# EAGLE design msgeq7-simple (EAGLE 6.5.0)
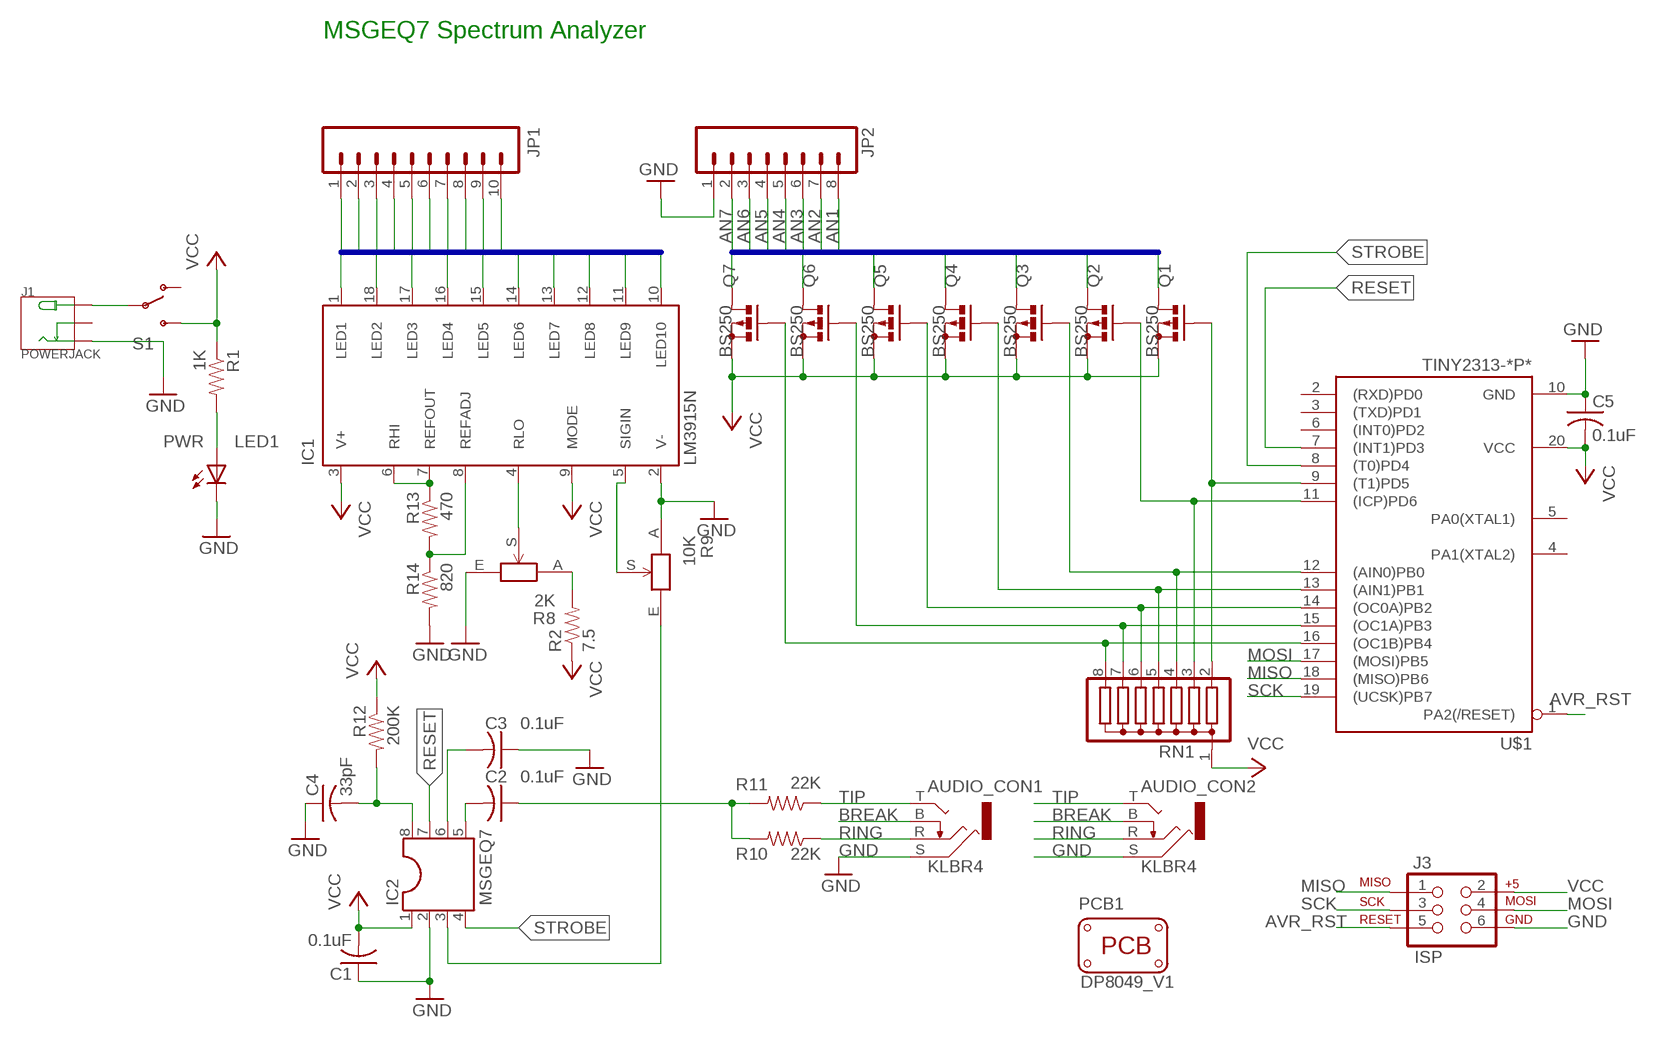
[diagram p0: schematic, sheet 1]

## Parts
AUDIO_CON1  KLBR4  [KLBR4]
AUDIO_CON2  KLBR4  [KLBR4]
C1  0.1uF  C-US025-025X050  [C025-025X050]
C2  0.1uF  C-US025-025X050  [C025-025X050]
C3  0.1uF  C-US025-025X050  [C025-025X050]
C4  33pF  C-US025-025X050  [C025-025X050]
C5  0.1uF  C-US025-025X050  [C025-025X050]
IC1  LM3915N  [DIL18]
IC2  MSGEQ7  DIL8  [DIL08]
J1  POWERJACK  JACK-DC-3P-3410020P1  [PW-3P-2.1]
J3  ISP  AVR_SPI_PRG_6PTH  [2X3]
JP1  M10"  [1X10]
JP2  M081X08  [1X08]
LED1  PWR  LED3MM  [LED3MM]
PCB1  PCB_DP_RECTANGLE-80X49  [DP8049_V1]
Q1  BS250  BS250TO92-E  [TO92-E-LINE]
Q2  BS250  BS250TO92-E  [TO92-E-LINE]
Q3  BS250  BS250TO92-E  [TO92-E-LINE]
Q4  BS250  BS250TO92-E  [TO92-E-LINE]
Q5  BS250  BS250TO92-E  [TO92-E-LINE]
Q6  BS250  BS250TO92-E  [TO92-E-LINE]
Q7  BS250  BS250TO92-E  [TO92-E-LINE]
R1  1K  RESISTORPTH-1/4W  [AXIAL-0.4]
R2  7.5  RESISTORPTH-1/4W  [AXIAL-0.4]
R8  2K  TPOT3352  [3352T]
R9  10K  TPOT3352  [3352T]
R10  22K  RESISTORPTH-1/4W  [AXIAL-0.4]
R11  22K  RESISTORPTH-1/4W  [AXIAL-0.4]
R12  200K  RESISTORPTH-1/4W  [AXIAL-0.4]
R13  470  RESISTORPTH-1/4W  [AXIAL-0.4]
R14  820  RESISTORPTH-1/4W  [AXIAL-0.4]
RN1  G07R  [SIL8]
S1  SWITCH-SPDTPTH  [SWITCH-SPDT]
U$1  TINY2313-*P*  [DIL20]

## Nets
AN1: JP2.8 Q1.D
AN2: JP2.7 Q2.D
AN3: JP2.6 Q3.D
AN4: JP2.5 Q4.D
AN5: JP2.4 Q5.D
AN6: JP2.3 Q6.D
AN7: JP2.2 Q7.D
AVR_RST: J3.5 U$1.1(PA2(/RESET))
BREAK: AUDIO_CON1.B AUDIO_CON2.B
CAT1: IC1.1(LED1) JP1.1
CAT2: IC1.18(LED2) JP1.2
CAT3: IC1.17(LED3) JP1.3
CAT4: IC1.16(LED4) JP1.4
CAT5: IC1.15(LED5) JP1.5
CAT6: IC1.14(LED6) JP1.6
CAT7: IC1.13(LED7) JP1.7
CAT8: IC1.12(LED8) JP1.8
CAT9: IC1.11(LED9) JP1.9
CAT10: IC1.10(LED10) JP1.10
GND: AUDIO_CON1.S AUDIO_CON2.S C1.1 C3.1 C4.1 C5.1 IC1.2(V-) IC2.2 J1.-1(-) J3.6 JP2.1 LED1.K(C) R8.E R9.A R14.P$2 U$1.10(GND)
MISO: J3.1 U$1.18((MISO)PB6)
MOSI: J3.4 U$1.17((MOSI)PB5)
N$1: Q7.G RN1.8 U$1.16((OC1B)PB4)
N$2: Q6.G RN1.7 U$1.15((OC1A)PB3)
N$3: Q5.G RN1.6 U$1.14((OC0A)PB2)
N$4: Q4.G RN1.5 U$1.13((AIN1)PB1)
N$5: Q3.G RN1.4 U$1.12((AIN0)PB0)
N$6: Q2.G RN1.3 U$1.11((ICP)PD6)
N$7: Q1.G RN1.2 U$1.9((T1)PD5)
N$8: IC1.4(RLO) R8.S
N$9: IC1.5(SIGIN) R9.S
N$10: C2.2 IC2.5
N$11: IC2.3 R9.E
N$12: J1.+ S1.2(P)
N$13: C2.1 R10.P$2 R11.P$2
N$14: C3.2 IC2.6
N$15: C4.2 IC2.8 R12.P$2
N$16: IC1.6(RHI) IC1.7(REFOUT) R13.P$1
N$17: IC1.8(REFADJ) R13.P$2 R14.P$1
N$18: LED1.A R1.P$2
N$19: R2.P$2 R8.A
RESET: IC2.7 U$1.7((INT1)PD3)
RING: AUDIO_CON1.R AUDIO_CON2.R R10.P$1
SCK: J3.3 U$1.19((UCSK)PB7)
STROBE: IC2.4 U$1.8((T0)PD4)
TIP: AUDIO_CON1.T AUDIO_CON2.T R11.P$1
VCC: C1.2 C5.2 IC1.3(V+) IC1.9(MODE) IC2.1 J3.2 Q1.S Q2.S Q3.S Q4.S Q5.S Q6.S Q7.S R1.P$1 R2.P$1 R12.P$1 RN1.1 S1.3(S) U$1.20(VCC)
Unconnected: J1.-2(CDN) S1.1(O) U$1.2((RXD)PD0) U$1.3((TXD)PD1) U$1.4(PA1(XTAL2)) U$1.5(PA0(XTAL1)) U$1.6((INT0)PD2)

## Buses
CAT[1..10]
AN[1..7]

## Notes on the sheet
- MSGEQ7 Spectrum Analyzer

## Library data of the parts
AUDIO_CON1 AUDIO_CON2 = ubiyubix:KLBR4
C1-C5 = rcl:C-US: CAPACITOR, American symbol
IC1 = national-semiconductor:LM391: Dot/Bar Display Driver Source: Data sheet LM3915 <http://www.national.com/ds/LM/LM3915.pdf> Data sheet LM3914 <http://www.national.com/ds/LM/LM3914.pdf>
IC2 = ic-package:DIL8: Dual In Line / Socket
J1 = Connector:JACK-DC-3P
J3 = SparkFun-Connectors:AVR_SPI_PRG_6: AVR ISP 6 Pin This is the reduced ISP connector for AVR programming. Common on Arduino. This footprint will take up less PCB space and can be used with a 10-pin to 6-pin adapter such as SKU: BOB-08508
JP1 = SparkFun-Connectors:M10: Header 10 Standard 10-pin 0.1" header. Use with straight break away headers (SKU : PRT-00116), right angle break away headers (PRT-00553), swiss pins (PRT-00743), machine pins (PRT-00117), and female headers (PRT-00115).
JP2 = SparkFun-Connectors:M08: Header 8 Standard 8-pin 0.1" header. Use with straight break away headers (SKU : PRT-00116), right angle break away headers (PRT-00553), swiss pins (PRT-00743), machine pins (PRT-00117), and female headers (PRT-00115).
LED1 = adafruit:LED: LED OSRAM: - CHIPLED LG R971, LG N971, LY N971, LG Q971, LY Q971, LO R971, LY R971 LH N974, LH R974 LS Q976, LO Q976, LY Q976 LO Q996 - Hyper CHIPLED LW Q18S LB Q993, LB Q99A, LB R99A - SideLED LS A670, LO A670, LY A670, LG A670, LP A670 LB A673, LV A673, LT A673, LW A673 LH A674 LY A675 LS A676, LA A676, LO A676, LY A676, LW A676 LS A679, LY A679, LG A679 - Hyper Micro SIDELED® LS Y876, LA Y876, LO Y876, LY Y876 LT Y87S - SmartLED LW L88C, LW L88S LB L89C, LB L89S, LG L890 LS L89K, LO L89K, LY L89K LS L896, LA L896, LO L896, LY L896 - TOPLED LS T670, LO T670, LY T670, LG T670, LP T670 LSG T670, LSP T670, LSY T670, LOP T670, LYG T670 LG T671, LOG T671, LSG T671 LB T673, LV T673, LT T673, LW T673 LH T674 LS T676, LA T676, LO T676, LY T676, LB T676, LH T676, LSB T676, LW T676 LB T67C, LV T67C, LT T67C, LS T67K, LO T67K, LY T67K, LW E67C LS E67B, LA E67B, LO E67B, LY E67B, LB E67C, LV E67C, LT E67C LW T67C LS T679, LY T679, LG T679 LS T770, LO T770, LY T770, LG T770, LP T770 LB T773, LV T773, LT T773, LW T773 LH T774 LS E675, LA E675, LY E675, LS T675 LS T776, LA T776, LO T776, LY T776, LB T776 LHGB T686 LT T68C, LB T68C - Hyper Mini TOPLED® LB M676 - Mini TOPLED Santana® LG M470 LS M47K, LO M47K, LY M47K Source: http://www.osram.convergy.de/
PCB1 = dp_devices:PCB_DP_RECTANGLE: Dangerous Prototypes Standard Rectangular PCB sizes; PCB_SIZE: DP8049_V1
Q1-Q7 = ubiyubix:BS250: P-CHANNEL MOS FET
R1 R2 R10-R14 = SparkFun-Passives:RESISTOR: Resistor Basic schematic elements and footprints for 0603, 1206, and PTH resistors.
R8 R9 = t0mpr1c3:TPOT: Bourns thumbwheel trimmer resistor
RN1 = resistor-sil:G07R: SIL RESISTOR; OC_FARNELL: unknown; OC_NEWARK: unknown
S1 = ubiyubix:SWITCH-SPDT: SPST Switch Simple slide switch. Spark Fun Electronics SKU : COM-00102
U$1 = avr-7:TINY2313*: Atmel Tiny2313 2K Flash, 128 bytes EEPROM, 128 bytes RAM

## Net classes
0 default: width 0.305 mm, clearance 0.305 mm
1 supply: width 0.406 mm

## Board
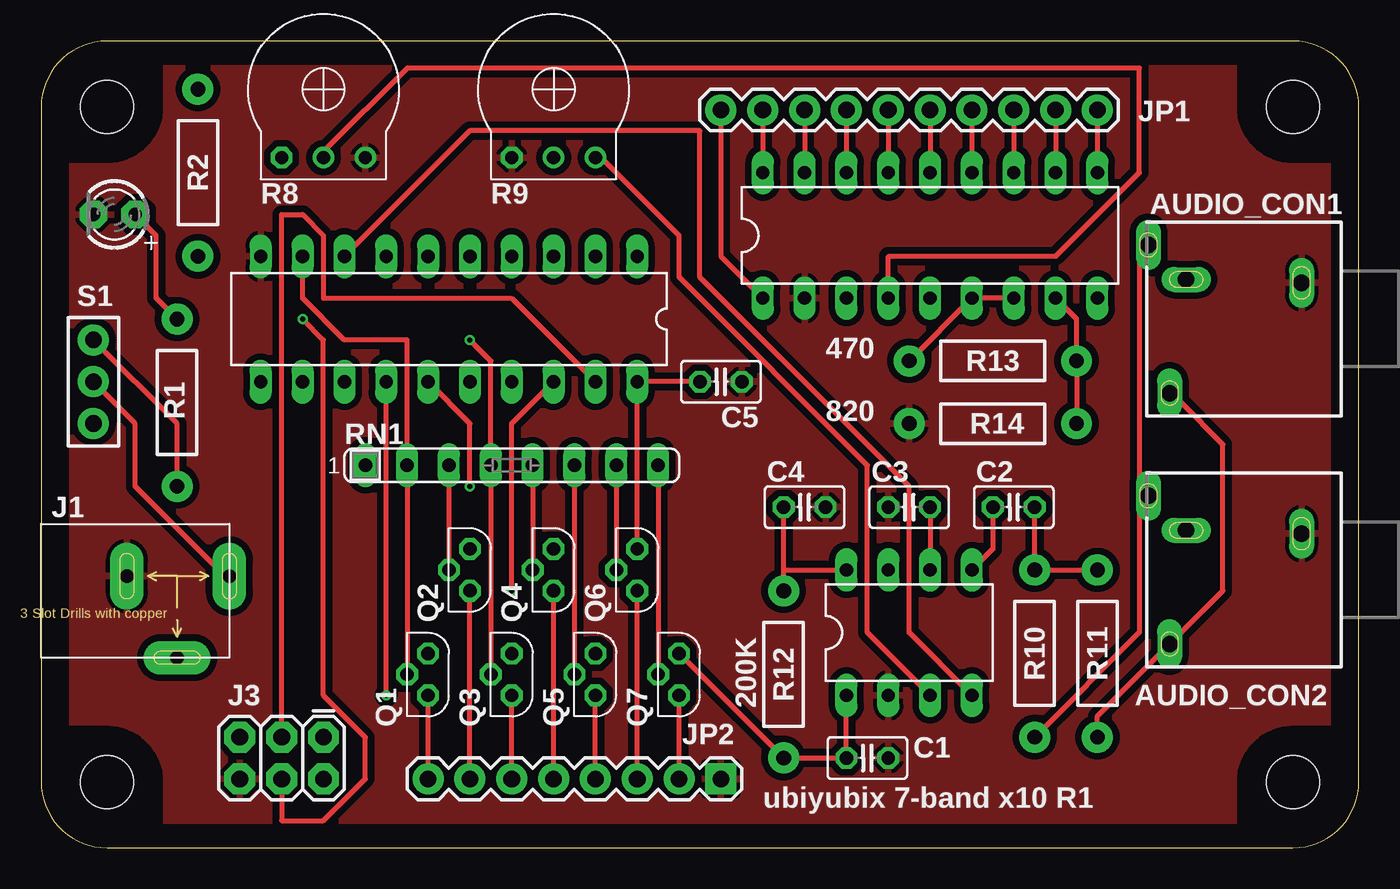
[diagram p1: board, top side]
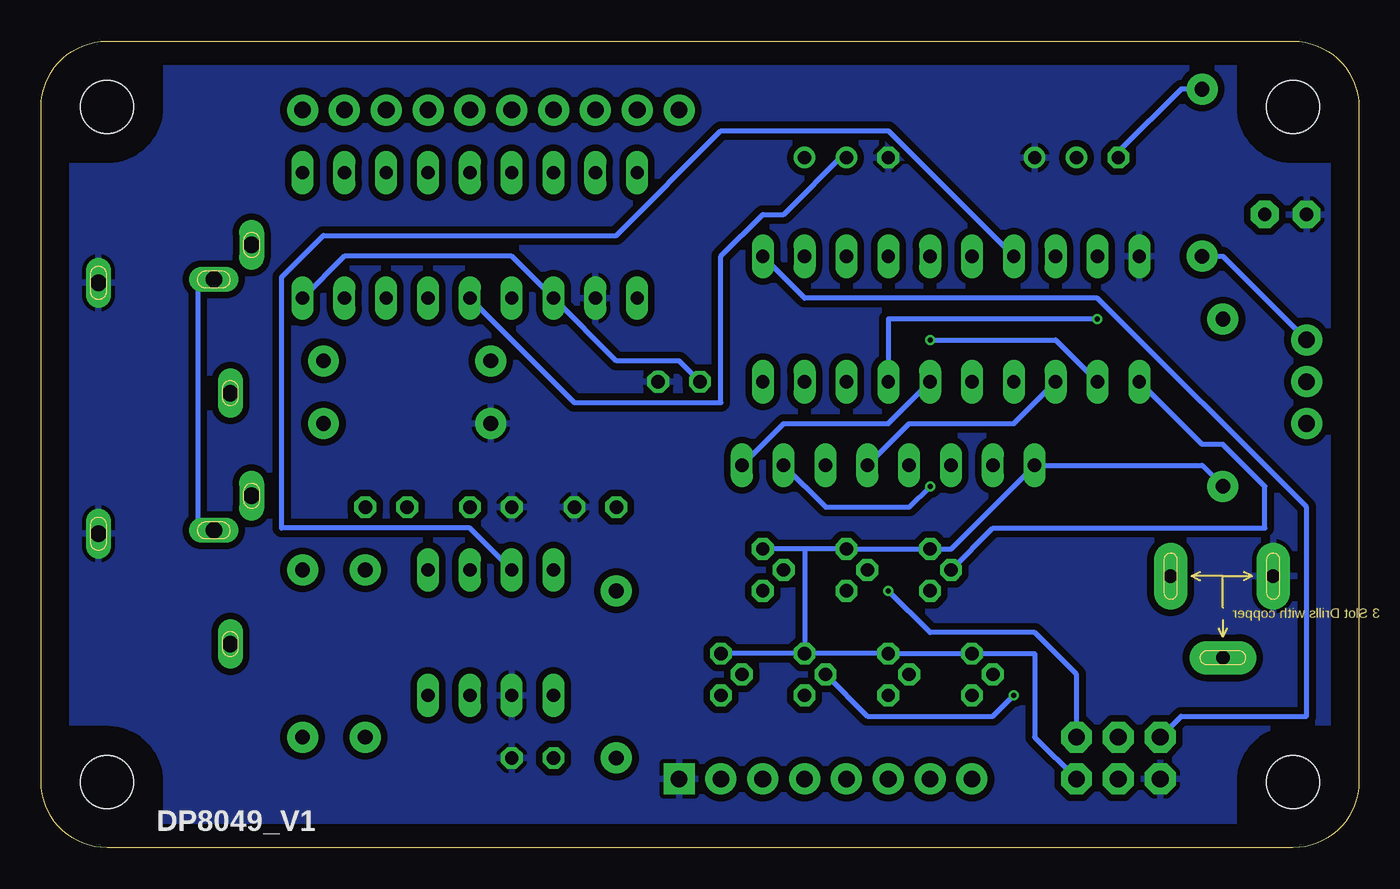
[diagram p2: board, bottom side, seen from below]

Size 80 x 49 mm. Coordinates in mm from the lower left corner, seen from the top.
Copper layers (1*16): Top 0.035mm / dielectric 1.5mm / Bottom 0.035mm
Design rules "SeeedStudio_2layer_DRU_no_angle_20140221": minimum track width 6mil, minimum drill 12mil, track to track 6mil, track to pad 6mil, pad to pad 6mil, via to via 6mil, smd to smd 0mil, copper to edge 10mil, drill to drill 10mil, minimum pad ring 10mil, minimum via ring 6mil, stop-mask expansion 2mil, vias tented up to drill 100mil, thermal gap 10mil

### Footprints (pad centres in the part's own frame; a part is rotated, then mirrored left to right if it is on the bottom)
KLBR4 = drill 1 pad 1.3 long: B -2.4,-3.5; S -2.2,3.5 | drill 1 pad 1.2 long: R -4.5,-5.8; T 4.5,-4.5
C025-025X050 = drill 0.813 octagon: 1 -1.27,0; 2 1.27,0
DIL18 = drill 0.813 long: 1 -10.16,-3.81; 2 -7.62,-3.81; 3 -5.08,-3.81; 4 -2.54,-3.81; 5 0,-3.81; 6 2.54,-3.81; 7 5.08,-3.81; 8 7.62,-3.81; 9 10.16,-3.81; 10 10.16,3.81; 11 7.62,3.81; 12 5.08,3.81; 13 2.54,3.81; 14 0,3.81; 15 -2.54,3.81; 16 -5.08,3.81; 17 -7.62,3.81; 18 -10.16,3.81
DIL08 = drill 0.813 long: 1 -3.81,-3.81; 2 -1.27,-3.81; 3 1.27,-3.81; 4 3.81,-3.81; 5 3.81,3.81; 6 1.27,3.81; 7 -1.27,3.81; 8 -3.81,3.81
PW-3P-2.1 = drill 0.813 pad 2.032 long: + 6.985,0.889; -1 0.762,0.889; -2 3.81,-4.064
2X3 = drill 1.016 pad 1.88 octagon: 1 0,0; 2 0,2.54; 3 2.54,0; 4 2.54,2.54; 5 5.08,0; 6 5.08,2.54
1X10 = drill 1.016 pad 1.88: 1 0,0; 2 2.54,0; 3 5.08,0; 4 7.62,0; 5 10.16,0; 6 12.7,0; 7 15.24,0; 8 17.78,0; 9 20.32,0; 10 22.86,0
1X08 = drill 1.016 pad 1.88 square: 1 0,0 | drill 1.016 pad 1.88: 2 2.54,0; 3 5.08,0; 4 7.62,0; 5 10.16,0; 6 12.7,0; 7 15.24,0; 8 17.78,0
LED3MM = drill 0.813 pad 1.676 octagon: A -1.27,0; K 1.27,0
DP8049_V1 = hole 3.2: -36,-20.5; 36,-20.5; 36,20.5; -36,20.5
TO92-E-LINE = drill 0.813 octagon: D -1.27,0; G 0,1.27; S 1.27,0
AXIAL-0.4 = drill 0.9 pad 1.88: P$1 -5.08,0; P$2 5.08,0
3352T = drill 0.8 pad 1.27 octagon: A -2.54,-4.16 | drill 0.8 pad 1.27: E 2.54,-4.16; S 0,-4.16
SIL8 = drill 0.813 long: 1 -8.89,0; 2 -6.35,0; 3 -3.81,0; 4 -1.27,0; 5 1.27,0; 6 3.81,0; 7 6.35,0; 8 8.89,0
SWITCH-SPDT = drill 1.016 pad 1.88: 1 0,2.54; 2 0,0; 3 0,-2.54
DIL20 = drill 0.813 long: 1 -11.43,-3.81; 2 -8.89,-3.81; 3 -6.35,-3.81; 4 -3.81,-3.81; 5 -1.27,-3.81; 6 1.27,-3.81; 7 3.81,-3.81; 8 6.35,-3.81; 9 8.89,-3.81; 10 11.43,-3.81; 11 11.43,3.81; 12 8.89,3.81; 13 6.35,3.81; 14 3.81,3.81; 15 1.27,3.81; 16 -1.27,3.81; 17 -3.81,3.81; 18 -6.35,3.81; 19 -8.89,3.81; 20 -11.43,3.81

### Placement (x,y rotation side)
AUDIO_CON1  73.02,32.12 270 top
AUDIO_CON2  73.02,16.88 270 top
C1  50.16,5.45 180 top
C2  59.05,20.69 180 top
C3  52.7,20.69 0 top
C4  46.35,20.69 180 top
C5  41.27,28.31 180 top
IC1  53.97,37.2 0 top
IC2  52.7,13.07 0 top
J1  4.44,15.61 0 top
J3  17.14,6.72 180 top
JP1  41.27,44.82 0 top
JP2  41.27,4.18 180 top
LED1  4.44,38.47 180 top
PCB1  40,24.5 0 top
Q1  23.49,10.53 90 top
Q2  26.03,16.88 90 top
Q3  28.57,10.53 90 top
Q4  31.11,16.88 90 top
Q5  33.65,10.53 90 top
Q6  36.19,16.88 90 top
Q7  38.73,10.53 90 top
R1  8.25,27.04 90 top
R2  9.52,41.01 90 top
R8  17.14,46.09 0 top
R9  31.11,46.09 0 top
R10  60.32,11.8 90 top
R11  64.13,11.8 90 top
R12  45.08,10.53 90 top
R13  57.78,29.58 0 top
R14  57.78,25.77 180 top
RN1  28.57,23.23 0 top
S1  3.17,28.31 180 top
U$1  24.76,32.12 180 top

### Tracks (layer width: path | path; a pad name or v marks a point on that pad's centre or on a via)
AN1
  Top 0.305: JP2.8 Q1.D
AN2
  Top 0.305: JP2.7 Q2.D
AN3
  Top 0.305: JP2.6 Q3.D
AN4
  Top 0.305: JP2.5 Q4.D
AN5
  Top 0.305: JP2.4 Q5.D
AN6
  Top 0.305: JP2.3 Q6.D
AN7
  Top 0.305: JP2.2 Q7.D
AVR_RST
  Bottom 0.305: U$1.1 33.65,33.39 15.87,33.39 3.17,20.69 3.17,7.99 10.79,7.99 J3.5
BREAK
  Bottom 0.305: AUDIO_CON2.B 70.48,19.42 70.48,34.66 AUDIO_CON1.B
CAT1
  Top 0.305: IC1.1 41.27,35.93 JP1.1
CAT2
  Top 0.305: JP1.2 IC1.18
CAT3
  Top 0.305: JP1.3 IC1.17
CAT4
  Top 0.305: JP1.4 IC1.16
CAT5
  Top 0.305: JP1.5 IC1.15
CAT6
  Top 0.305: JP1.6 IC1.14
CAT7
  Top 0.305: JP1.7 IC1.13
CAT8
  Top 0.305: JP1.8 IC1.12
CAT9
  Top 0.305: JP1.9 IC1.11
CAT10
  Top 0.305: JP1.10 IC1.10
GND
  pour Bottom (isolate 0.406): 1.9,47.36 78.1,47.36 78.1,1.64 1.9,1.64
  pour Top (isolate 0.406): 1.9,47.36 78.1,47.36 78.1,1.64 1.9,1.64
MISO  (via drill 0.3)
  Top 0.305: U$1.18 28.57,25.77 v28.57,15.61
  Bottom 0.305: v28.57,15.61 26.03,13.07 19.68,13.07 17.14,10.53 J3.1
MOSI  (via drill 0.3)
  Top 0.305: v15.87,32.12 17.14,30.85 17.14,9.26 19.68,6.72 19.68,4.18 17.14,1.64 14.6,1.64 J3.4
  Bottom 0.305: U$1.17 28.57,32.12 v15.87,32.12
N$1
  Top 0.305: RN1.8 Q7.G
  Bottom 0.305: U$1.16 28.57,25.77 34.92,25.77 RN1.8
N$2  (via drill 0.3)
  Top 0.305: RN1.7 Q6.G | U$1.15 26.03,25.77 v26.03,21.96
  Bottom 0.305: v26.03,21.96 27.3,20.69 32.38,20.69 RN1.7
N$3  (via drill 0.3)
  Top 0.305: RN1.6 Q5.G | v20.95,9.26 U$1.14
  Bottom 0.305: v20.95,9.26 22.22,7.99 29.84,7.99 Q5.G
N$4
  Top 0.305: RN1.5 Q4.G
  Bottom 0.305: U$1.13 20.95,25.77 27.3,25.77 RN1.5
N$5  (via drill 0.3)
  Top 0.305: Q3.G RN1.4 27.3,29.58 v26.03,30.85
  Bottom 0.305: U$1.12 18.41,30.85 v26.03,30.85
N$6
  Top 0.305: RN1.3 Q2.G
  Bottom 0.305: U$1.11 9.52,24.5 8.25,24.5 5.71,21.96 5.71,19.42 22.22,19.42 Q2.G
N$7
  Top 0.305: Q1.G RN1.2 22.22,30.85 18.41,30.85 15.87,33.39 U$1.9
N$8
  Top 0.305: IC1.4 51.43,35.93 61.59,35.93 66.67,41.01 66.67,47.36 22.22,47.36 17.14,42.28 R8.S
N$9
  Bottom 0.305: IC1.5 47.62,27.04 38.73,27.04 38.73,35.93 36.19,38.47 34.92,38.47 31.11,42.28 R9.S
N$10
  Top 0.305: IC2.5 57.78,18.15 C2.2
N$11
  Top 0.305: IC2.3 50.16,13.07 50.16,23.23 38.73,34.66 38.73,37.2 33.65,42.28 R9.E
N$12
  Top 0.305: S1.2 5.71,25.77 5.71,21.96 10.79,16.88 J1.+
N$13
  Top 0.305: C2.1 R10.P$2 R11.P$2
N$14
  Top 0.305: C3.2 IC2.6
N$15
  Top 0.305: R12.P$2 45.08,16.88 | 45.08,16.88 C4.2 | 45.08,16.88 IC2.8
N$16
  Top 0.305: IC1.7 IC1.6 R13.P$1
N$17
  Top 0.305: IC1.8 62.86,32.12 R13.P$2 R14.P$1
N$18
  Top 0.305: LED1.A 6.98,37.2 6.98,33.39 R1.P$2
N$19
  Bottom 0.305: R2.P$2 10.79,46.09 14.6,42.28 R8.A
RESET
  Bottom 0.305: U$1.7 28.57,43.55 38.73,43.55 45.08,37.2 62.86,37.2 65.4,34.66 65.4,19.42 53.97,19.42 IC2.7
RING
  Top 0.305: AUDIO_CON1.R 66.67,35.93 66.67,21.96 AUDIO_CON2.R 66.67,20.69 66.67,13.07 R10.P$1
SCK
  Top 0.305: U$1.19 28.57,33.39 17.14,33.39 17.14,37.2 15.87,38.47 14.6,38.47 J3.3
STROBE
  Top 0.305: U$1.8 26.03,43.55 40,43.55 40,34.66 52.7,21.96 52.7,13.07 IC2.4
TIP
  Top 0.305: R11.P$1 64.13,7.99 AUDIO_CON2.T 71.75,15.61 71.75,24.5 69.21,27.04 AUDIO_CON1.T
VCC
  Top 0.305: IC2.1 C1.2 R12.P$1 Q7.S | C5.2 U$1.20 Q6.S | S1.3 8.25,25.77 R1.P$1
  Bottom 0.305: Q5.S Q3.S Q1.S 19.68,11.8 19.68,6.72 J3.2 | Q5.S Q7.S | C5.2 41.27,29.58 45.08,29.58 IC1.3 51.43,35.93 61.59,35.93 IC1.9 | S1.3 8.25,35.93 R2.P$1 | 33.65,18.15 Q4.S Q2.S 24.76,18.15 RN1.1 9.52,23.23 R1.P$1 | 33.65,18.15 Q6.S | 33.65,18.15 Q5.S

### Text on the board
tNames: ubiyubix 7-band x10 R1